# EasyEDA schematic 1-Schematic_ESQUEM_TICO UTP-100.json
TITLE: UTP-100 "Diagrama Esquemático"; REV: 1.0; Date: 2021-03-28; Sheet: 1/1; Drawn By: Joseph Flores; Company: UTP
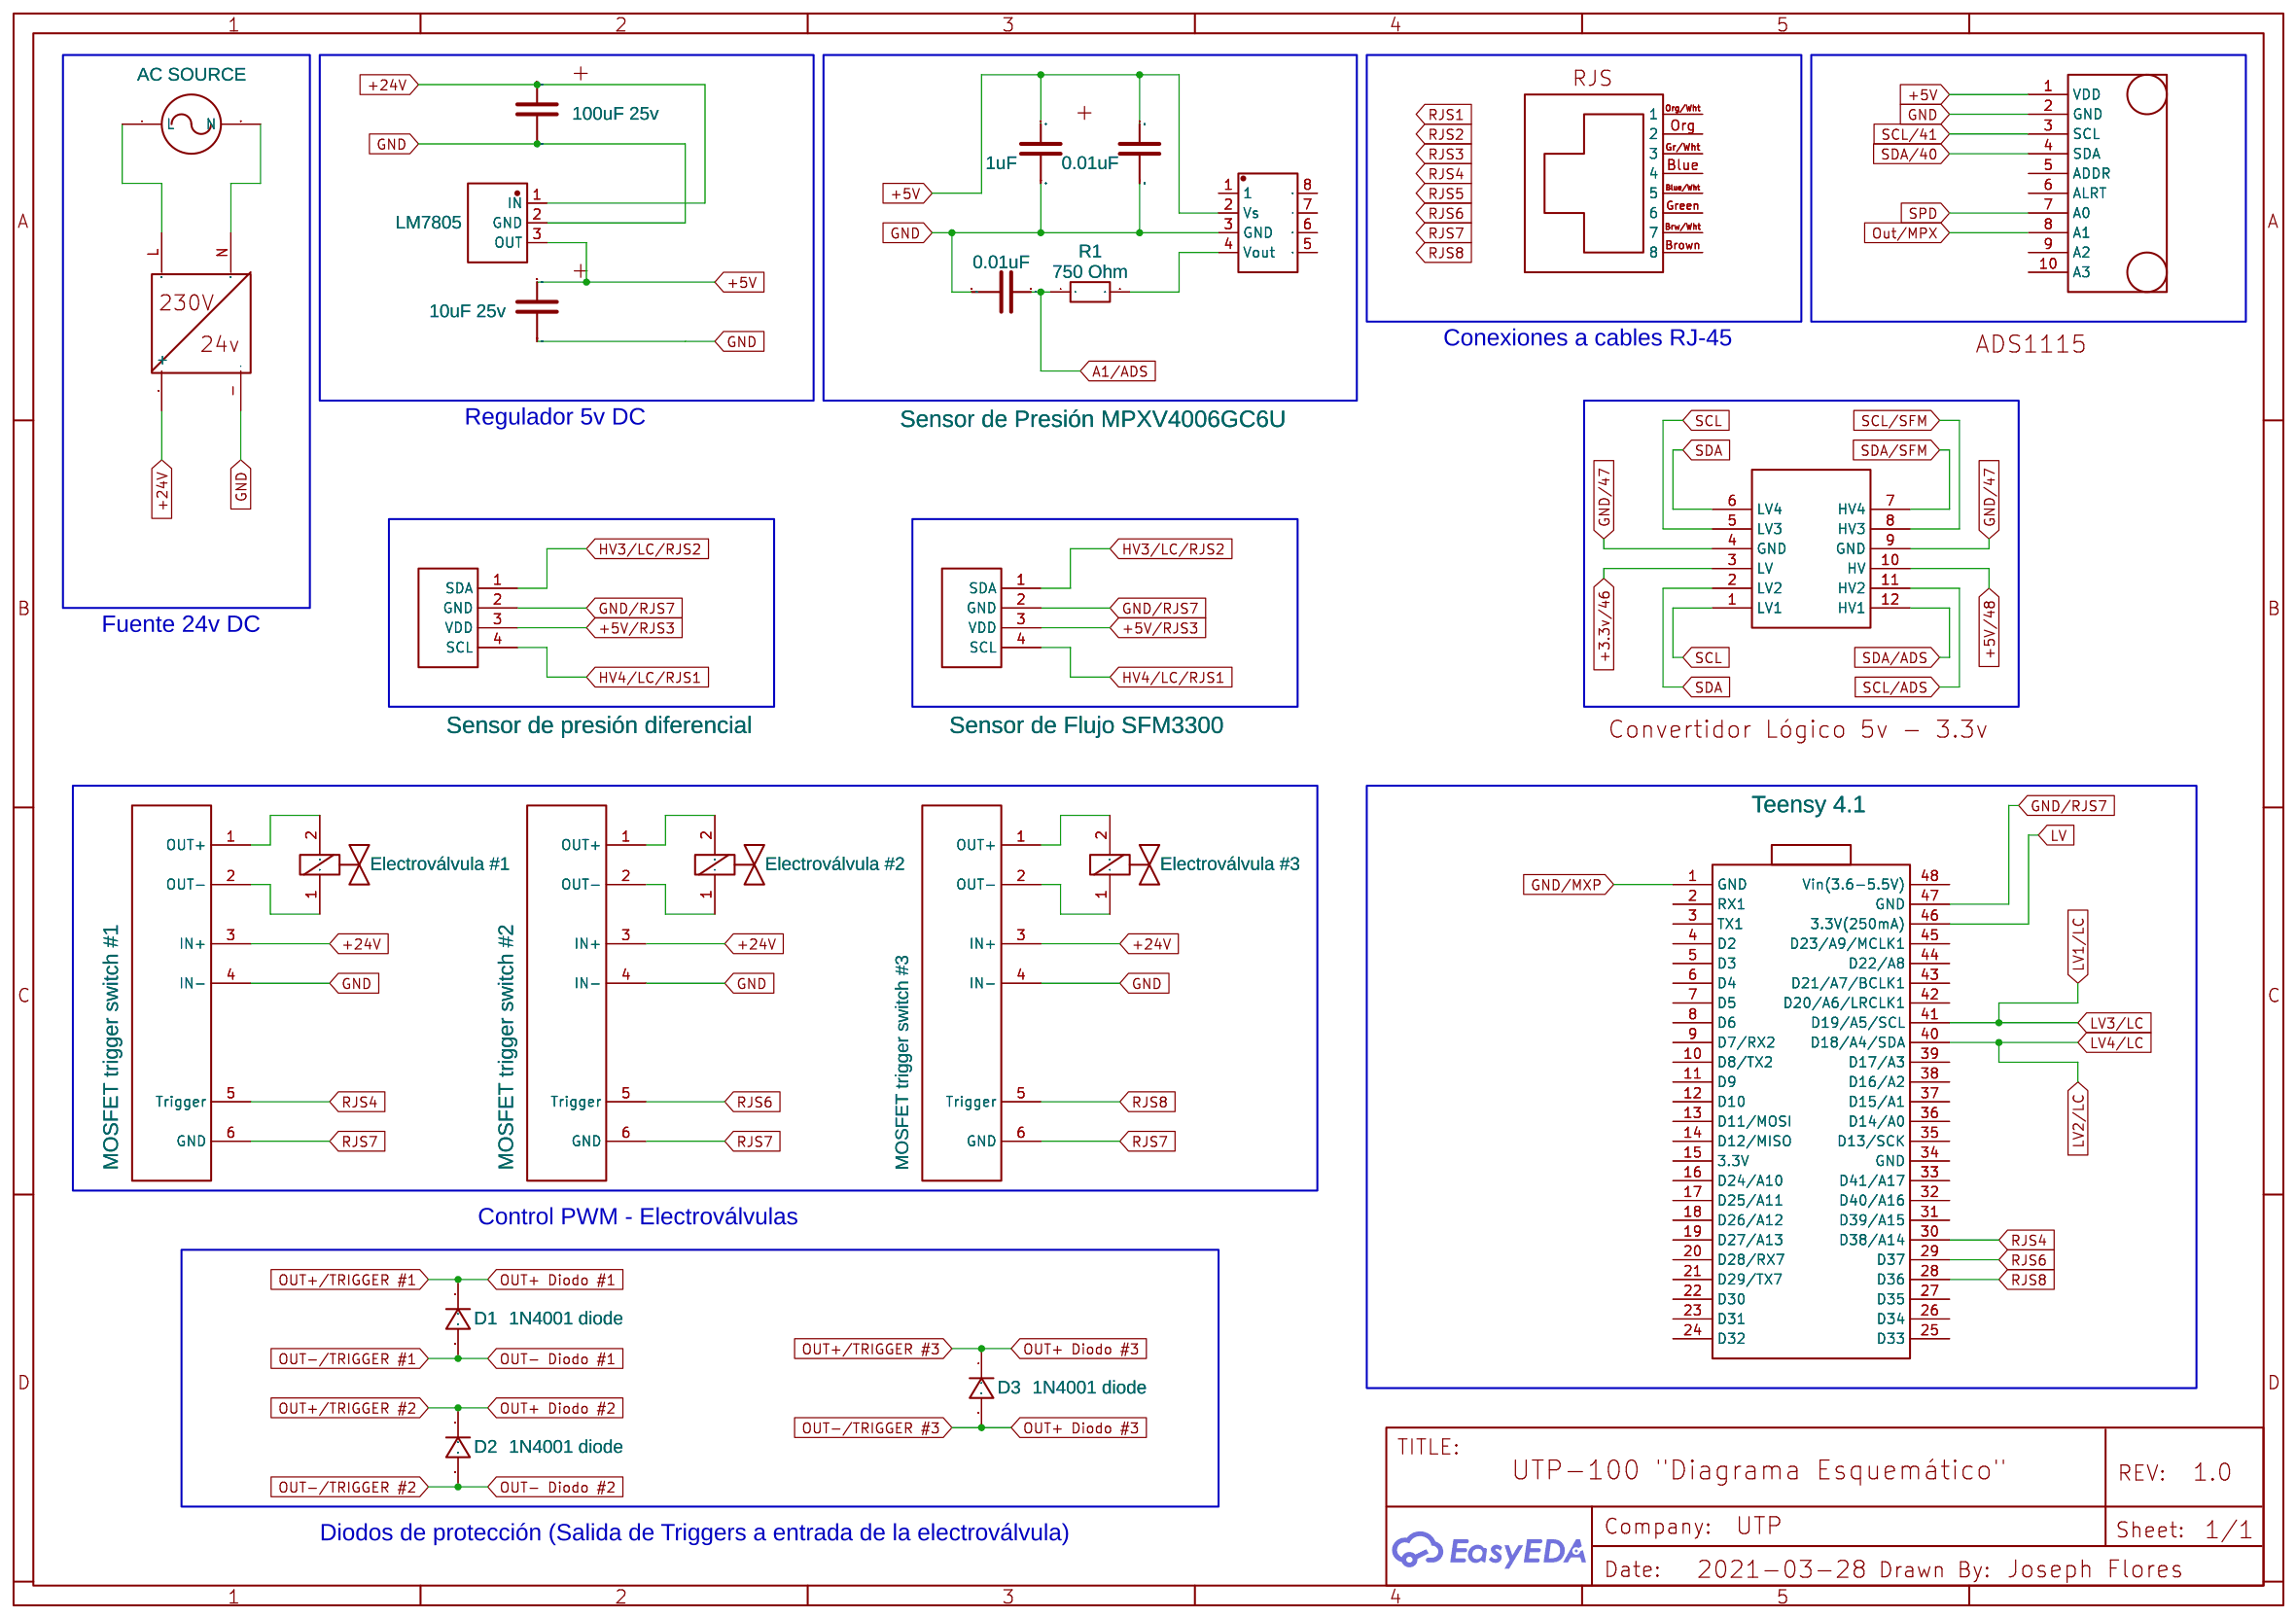
[diagram p0: schematic sheet]

## Parts
D1  1N4001 diode  [DIODE 1N40001]
D2  1N4001 diode  [DIODE 1N40001]
D3  1N4001 diode  [DIODE 1N40001]
R1  750 Ohm  [R0201]
U1  Teensy 4.1  [TEENSY 4.1 TVG]
U2  ADS1115  [ADS1115]
U3  Sensor de Flujo SFM3300
U4  Sensor de Presión MPXV4006GC6U  [SENSOR-SMD_482A-01]
U5  MOSFET trigger switch #1  [MOSFET TRIGGER SWITCH]
U6  4bits Logic Level Converter Module 5V 3.3V  [4BITS_LOGIC_LEVEL_CONVERTER_BIDIRECTIONAL_5V_33V-10MM]
U7  Sensor de presión diferencial
U8  RJ45  [RJ45 CHINA PLASTIC]
U9  Power_supply_24v  [POWER_SUPPLY_5V]
U10  MOSFET trigger switch #2  [MOSFET TRIGGER SWITCH]
U11  MOSFET trigger switch #3  [MOSFET TRIGGER SWITCH]
U12  AC SOURCE
U13  Electroválvula #1
U14  Electroválvula #2
U15  Electroválvula #3
U17  LM7805  [TO-220-3_L10.0-W4.5-P2.54-L]
U19  100uF 25v  [TWO_IO]
U20  10uF 25v  [TWO_IO]
U22  1uF  [TWO_IO]
U23  0.01uF  [RADIAL CAPACITOR 5MM]
U24  0.01uF  [RADIAL CAPACITOR 5MM]

## Library data of the parts
D1-D3 = 1N4007 diode: Supplier: elnino; Supplier Part: C331633; Manufacturer: GW; Manufacturer Part: 1N4007; Contributor: elnino
R1 = R_0201_EU: Contributor: LCEDA_Lib
U1 = Teensy 4.1 TVG: Manufacturer Part: Teensy 3.6; link: https://www.pjrc.com/store/teensy36.html; Contributor: pintea.mihaita
U2 = ADS1115: Contributor: Myk-13
U3 U7 = SFM3000: Manufacturer: SENSIRION; Contributor: joaocarlosmachadodepaivaaraujo
U4 = MPXV5050GC6U: Supplier: LCSC; Supplier Part: C16628; Manufacturer: Freescale Semicon; Contributor: LCSC
U5 U10 U11 = MOSFET trigger switch: Contributor: martin_4581
U6 = 4bits Logic Level Converter Module 5V 3.3V: Contributor: Игорь IOT; link: https://goo.gl/xLxZu8; Supplier: https://www.sparkfun.com/products/12009
U8 = RJ45: Supplier Part: OL-2624; link: http://www.aliexpress.com/item/New-Arrival-50-pcs-lot-Original-Package-RJ45-Connector-All-Plastic-Board-No-Shrapnel-Unshielded-RJ45/32452052800.html?spm=2114.13010608.0.0.NiPrdZ; Contributor: ImHuman; Package Display: No
U9 = Power_supply_24v: Manufacturer Part: Power supply 24v; Contributor: matystaCZ
U12 = AC SOURCE: Contributor: mindfusion
U13-U15 = solenoid valve: Contributor: ppankratow
U17 = LM7805: Supplier: LCSC; Supplier Part: C845394; Manufacturer: TF; Contributor: LCSC; LCSC Assembly: Yes; SMT Type: Extend; Paste Type: expand
U19 U20 U22-U24 = CAPACITOR

## Nets
+5V: U2.1(VDD) U4.2(Vs) U17.3(OUT) U20.P$1 U22.P$1 U23.P$1
+24V: U5.3(IN+) U9.3(+) U10.3(IN+) U11.3(IN+) U17.1(IN) U19.P$1
GND: U2.2(GND) U4.3(GND) U5.4(IN-) U9.- U10.4(IN-) U11.4(IN-) U17.2(GND) U19.P$2 U20.P$2 U22.P$2 U23.P$2 U24.P$2
+3.3v/46: U6.3(LV)
+5V/48: U6.10(HV)
+5V/RJS3: U3.3(VDD) U7.3(VDD)
A1/ADS: R1.1 U24.P$1
GND/47: U6.4(GND) U6.9(GND)
GND/MXP: U1.1(GND)
GND/RJS7: U1.47(GND) U3.2(GND) U7.2(GND)
HV3/LC/RJS2: U3.1(SDA) U7.1(SDA)
HV4/LC/RJS1: U3.4(SCL) U7.4(SCL)
LV: U1.46(3.3V(250mA))
LV1/LC: U1.41(D19/A5/SCL)
LV2/LC: U1.40(D18/A4/SDA)
OUT+ Diodo #1: D1.1
OUT+ Diodo #2: D2.1
OUT+ Diodo #3: D3.1 D3.2
OUT- Diodo #1: D1.2
OUT- Diodo #2: D2.2
Out/MPX: U2.8(A1)
RJS4: U1.30(D38/A14) U5.5(Trigger)
RJS6: U1.29(D37) U10.5(Trigger)
RJS7: U5.6(GND) U10.6(GND) U11.6(GND)
RJS8: U1.28(D36) U11.5(Trigger)
SCL: U6.1(LV1) U6.5(LV3)
SCL/41: U2.3(SCL)
SCL/ADS: U6.11(HV2)
SCL/SFM: U6.8(HV3)
SDA: U6.2(LV2) U6.6(LV4)
SDA/40: U2.4(SDA)
SDA/ADS: U6.12(HV1)
SDA/SFM: U6.7(HV4)
SPD: U2.7(A0)
Net-(R1-2): R1.2 U4.4(Vout)
Net-(U5-1): U5.1(OUT+) U13.2
Net-(U5-2): U5.2(OUT-) U13.1
Net-(U9-L): U9.L(pe) U12.1(L)
Net-(U9-N): U9.N(3) U12.2(N)
Net-(U10-1): U10.1(OUT+) U14.2
Net-(U10-2): U10.2(OUT-) U14.1
Net-(U11-1): U11.1(OUT+) U15.2
Net-(U11-2): U11.2(OUT-) U15.1

Not connected (* = marked no-connect by the designer): U1 2(RX1) 3(TX1) 4(D2) 5(D3) 6(D4) 7(D5) 8(D6) 9(D7/RX2) 10(D8/TX2) 11(D9) 12(D10) 13(D11/MOSI) 14(D12/MISO) 15(3.3V) 16(D24/A10) 17(D25/A11) 18(D26/A12) 19(D27/A13) 20(D28/RX7) 21(D29/TX7) 22(D30) 23(D31) 24(D32) 25(D33) 26(D34) 27(D35) 31(D39/A15) 32(D40/A16) 33(D41/A17) 34(GND) 35(D13/SCK) 36(D14/A0) 37(D15/A1) 38(D16/A2) 39(D17/A3) 42(D20/A6/LRCLK1) 43(D21/A7/BCLK1) 44(D22/A8) 45(D23/A9/MCLK1) 48(Vin(3.6-5.5V)); U2 5(ADDR) 6(ALRT) 9(A2) 10(A3); U4 1 5 6 7 8; U8 Blue(4) Blue/Wht(5) Brown(8) Brw/Wht(7) Gr/Wht(3) Green(6) Org(2) Org/Wht(1)

## Notes on the sheet
- Conexiones a cables RJ-45
- Regulador 5v DC
- Fuente 24v DC
- Control PWM - Electroválvulas
- Diodos de protección (Salida de Triggers a entrada de la electroválvula)
